# EAGLE design tiny_bot_v3 (EAGLE 6.5.0)
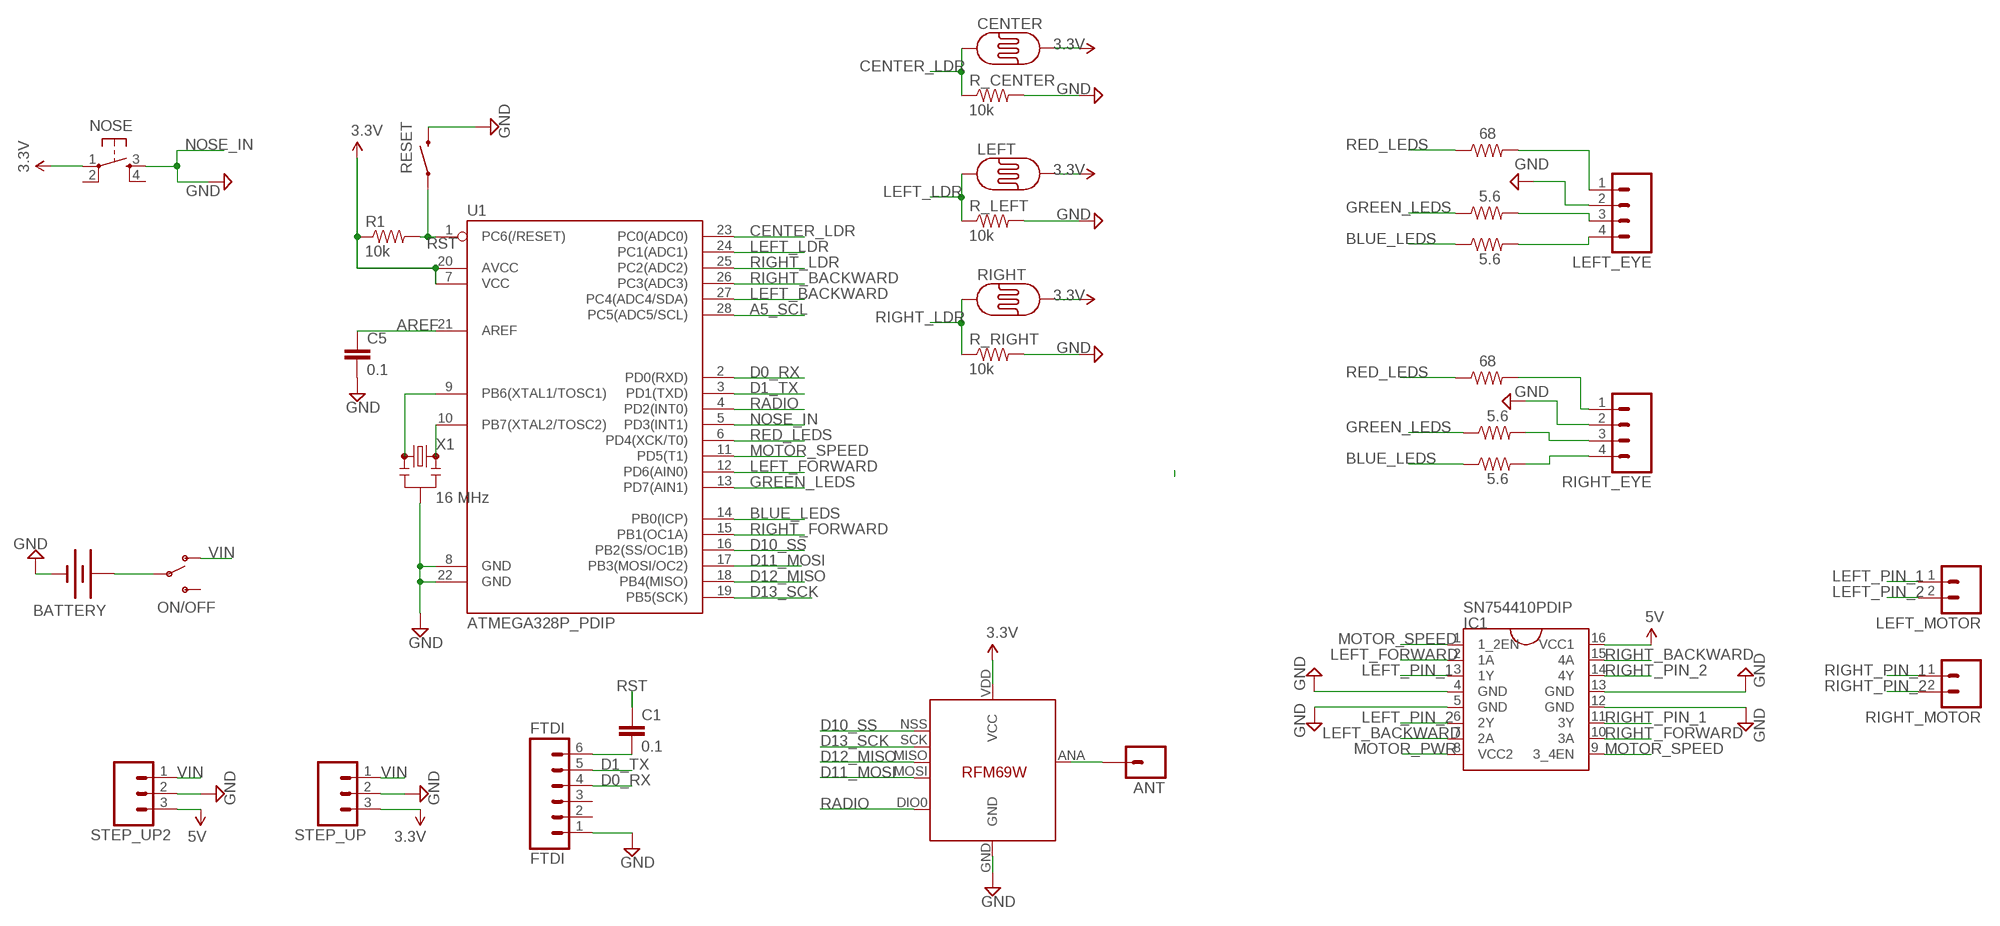
[diagram p0: schematic, sheet 1]

## Parts
ANT  M01PTH  [1X01]
BATTERY  BATTERYAAA  [BATTERY-AAA]
C1  0.1  CAPPTH  [CAP-PTH-SMALL]
C5  0.1  CAPPTH  [CAP-PTH-SMALL]
CENTER  PHOTOCELLPTH  [PHOTOCELL]
FTDI  FTDI  M06SIP  [1X06]
IC1  SN754410PDIP  [DIL16]
LEFT  PHOTOCELLPTH  [PHOTOCELL]
LEFT_BLUE  5.6  RESISTORPTH-1/4W  [AXIAL-0.4]
LEFT_EYE  M04LONGPADS  [1X04_LONGPADS]
LEFT_GREEN  5.6  RESISTORPTH-1/4W  [AXIAL-0.4]
LEFT_MOTOR  M02PTH  [1X02]
LEFT_RED  68  RESISTORPTH-1/4W  [AXIAL-0.4]
NOSE  TACTILE-SWITCH-PTH  [TAC-SWITCH-PTH]
ON/OFF  SWITCH-SPDTPTH  [SWITCH-SPDT]
R1  10k  RESISTORPTH-1/4W  [AXIAL-0.4]
R_CENTER  10k  RESISTORPTH-1/4W  [AXIAL-0.4]
R_LEFT  10k  RESISTORPTH-1/4W  [AXIAL-0.4]
R_RIGHT  10k  RESISTORPTH-1/4W  [AXIAL-0.4]
RESET  SWITCH-MOMENTARY-2SMD  [TACTILE-SWITCH-SMD]
RIGHT  PHOTOCELLPTH  [PHOTOCELL]
RIGHT_BLUE  5.6  RESISTORPTH-1/4W  [AXIAL-0.4]
RIGHT_EYE  M04LONGPADS  [1X04_LONGPADS]
RIGHT_GREEN  5.6  RESISTORPTH-1/4W  [AXIAL-0.4]
RIGHT_MOTOR  M02PTH  [1X02]
RIGHT_RED  68  RESISTORPTH-1/4W  [AXIAL-0.4]
STEP_UP  M03PTH  [1X03]
STEP_UP2  M03PTH  [1X03]
U1  ATMEGA328P_PDIP  [DIL28-3]
U$5  RFM69HW  RFM69  [RFM69W-MINPADS]
X1  16 MHz  RESONATORPTH  [RESONATOR-PTH]

## Nets
5V: IC1.16(VCC1) STEP_UP2.3
A5_SCL: U1.28(PC5(ADC5/SCL))
AREF: C5.1 U1.21(AREF)
BLUE_LEDS: LEFT_BLUE.P$1 RIGHT_BLUE.P$1 U1.14(PB0(ICP))
CENTER_LDR: CENTER.1 R_CENTER.P$1 U1.23(PC0(ADC0))
D0_RX: FTDI.4 U1.2(PD0(RXD))
D1_TX: FTDI.5 U1.3(PD1(TXD))
D10_SS: U1.16(PB2(SS/OC1B)) U$5.NSS(SEL)
D11_MOSI: U1.17(PB3(MOSI/OC2)) U$5.MOSI
D12_MISO: U1.18(PB4(MISO)) U$5.MISO
D13_SCK: U1.19(PB5(SCK)) U$5.SCK
GND [power]: BATTERY.GND@1(-) C5.2 FTDI.1 IC1.4(GND) IC1.5(GND) IC1.12(GND) IC1.13(GND) LEFT_EYE.2 R_CENTER.P$2 R_LEFT.P$2 R_RIGHT.P$2 RESET.3 RIGHT_EYE.2 STEP_UP2.2 STEP_UP.2 U1.8(GND) U1.22(GND) U$5.GND X1.2
GREEN_LEDS: LEFT_GREEN.P$1 RIGHT_GREEN.P$1 U1.13(PD7(AIN1))
LEFT_BACKWARD: IC1.7(2A) U1.27(PC4(ADC4/SDA))
LEFT_FORWARD: IC1.2(1A) U1.12(PD6(AIN0))
LEFT_LDR: LEFT.1 R_LEFT.P$1 U1.24(PC1(ADC1))
LEFT_PIN_1: IC1.3(1Y) LEFT_MOTOR.1
LEFT_PIN_2: IC1.6(2Y) LEFT_MOTOR.2
MOTOR_PWR: IC1.8(VCC2)
MOTOR_SPEED: IC1.1(1_2EN) IC1.9(3_4EN) U1.11(PD5(T1))
N$1: U1.9(PB6(XTAL1/TOSC1)) X1.1
N$2: ANT.1 U$5.ANA(ANT)
N$3: LEFT_EYE.1 LEFT_RED.P$2
N$4: RIGHT_EYE.1 RIGHT_RED.P$2
N$5: LEFT_EYE.3 LEFT_GREEN.P$2
N$6: LEFT_BLUE.P$2 LEFT_EYE.4
N$7: RIGHT_EYE.3 RIGHT_GREEN.P$2
N$8: RIGHT_BLUE.P$2 RIGHT_EYE.4
N$12: BATTERY.PWR@1(+) ON/OFF.2(P)
N$20: C1.2 FTDI.6
N$21: U1.10(PB7(XTAL2/TOSC2)) X1.3
NOSE_IN: NOSE.3 U1.5(PD3(INT1)) ; supply symbol labelled GND
RADIO: U1.4(PD2(INT0)) U$5.DIO0
RED_LEDS: LEFT_RED.P$1 RIGHT_RED.P$1 U1.6(PD4(XCK/T0))
RIGHT_BACKWARD: IC1.15(4A) U1.26(PC3(ADC3))
RIGHT_FORWARD: IC1.10(3A) U1.15(PB1(OC1A))
RIGHT_LDR: R_RIGHT.P$1 RIGHT.1 U1.25(PC2(ADC2))
RIGHT_PIN_1: IC1.11(3Y) RIGHT_MOTOR.1
RIGHT_PIN_2: IC1.14(4Y) RIGHT_MOTOR.2
RST: C1.1 R1.P$2 RESET.1 U1.1(PC6(/RESET))
VCC: CENTER.2 LEFT.2 NOSE.1 R1.P$1 RIGHT.2 STEP_UP.3 U1.7(VCC) U1.20(AVCC) U$5.VDD(VCC) ; supply symbol labelled 3.3V
VIN: ON/OFF.1(O) STEP_UP2.1 STEP_UP.1
Unconnected: FTDI.2 FTDI.3 NOSE.2 NOSE.4 ON/OFF.3(S)

## Library data of the parts
ANT = SparkFun-Connectors:M01: Header 1 Standard 1-pin 0.1" header. Use with straight break away headers (SKU : PRT-00116), right angle break away headers (PRT-00553), swiss pins (PRT-00743), machine pins (PRT-00117), and female headers (PRT-00115). SMTSO-256-ET is a "flush mount" nut for a 4-40 screw. The older package used to be too tight, and did not allow it to sit properly thru the drill hit. The latest (0.165DIA) fits nice and snug.
BATTERY = SparkFun-Electromechanical:BATTERY: Battery Holders Various common sizes : AA, AAA, 18650 (PRT-12895), 20mm coin cell and 12mm coin cell. 20MM_4LEGS, BATT-10373; PROD_ID: BATT-08571
C1 C5 = SparkFun-Passives:CAP: Capacitor Standard 0603 ceramic capacitor, and 0.1" leaded capacitor.
CENTER LEFT RIGHT = SparkFun-Sensors:PHOTOCELL: CdS photoresistor. This is a low cost way to detect light levels. Resistance decreases with more incoming light. SparkFun SKU: SEN-09088
FTDI = SparkFun-Connectors:M06: Header 6 Standard 6-pin 0.1" header. Use with straight break away headers (SKU : PRT-00116), right angle break away headers (PRT-00553), swiss pins (PRT-00743), machine pins (PRT-00117), and female headers (PRT-00115). Molex polarized connector foot print use with SKU : PRT-08094 with associated crimp pins and housings. NOTES ON THE VARIANTS LOCK and LOCK_LONGPADS... This footprint was designed to help hold the alignment of a through-hole component (i.e. 6-pin header) while soldering it into place. You may notice that each hole has been shifted either up or down by 0.005 of an inch from it's more standard position (which is a perfectly straight line). This slight alteration caused the pins (the squares in the middle) to touch the edges of the holes. Because they are alternating, it causes a "brace" to hold the component in place. 0.005 has proven to be the perfect amount of "off-center" position when using our standard breakaway headers. Although looks a little odd when you look at the bare footprint, once you have a header in there, the alteration is very hard to notice. Also, if you push a header all the way into place, it is covered up entirely on the bottom side. This idea of altering the position of holes to aid alignment will be further integrated into the Sparkfun Library for other footprints. It can help hold any component with 3 or more connection pins.
IC1 = AlexW-Eagle-Libraries:SN754410
LEFT_BLUE LEFT_GREEN LEFT_RED R1 R_CENTER R_LEFT R_RIGHT RIGHT_BLUE RIGHT_GREEN RIGHT_RED = SparkFun-Passives:RESISTOR: Resistor Basic schematic elements and footprints for 0603, 1206, and PTH resistors.
LEFT_EYE RIGHT_EYE = SparkFun-Connectors:M04: Header 4 Standard 4-pin 0.1" header. Use with straight break away headers (SKU : PRT-00116), right angle break away headers (PRT-00553), swiss pins (PRT-00743), machine pins (PRT-00117), and female headers (PRT-00115). Molex polarized connector foot print use with SKU : PRT-08231 with associated crimp pins and housings. 1MM SMD Version SKU: PRT-10208; PROD_ID: CONN-09696
LEFT_MOTOR RIGHT_MOTOR = SparkFun-Connectors:M02: Standard 2-pin 0.1" header. Use with - straight break away headers ( PRT-00116) - right angle break away headers (PRT-00553) - swiss pins (PRT-00743) - machine pins (PRT-00117) - female headers (PRT-00115) Molex polarized connector foot print use with: PRT-08233 with associated crimp pins and housings. 2.54_SCREWTERM for use with PRT-10571. 3.5mm Screw Terminal footprints for PRT-08084 5mm Screw Terminal footprints for use with PRT-08432
NOSE = GeekAmmo:TACTILE-SWITCH: Tactile Switch 4 Pins, SPST NO
ON/OFF = SparkFun-Electromechanical:SWITCH-SPDT: SPDT Switch Simple slide switch, Spark Fun Electronics SKU : COM-00102 DPDT SMT slide switch, AYZ0202, SWCH-08179; PROD_ID: SWCH-08261
RESET = SparkFun-Electromechanical:SWITCH-MOMENTARY-2: Various NO switches- pushbuttons, reed, etc; PROD_ID: SWCH-08247
STEP_UP STEP_UP2 = SparkFun-Connectors:M03: Header 3 Standard 3-pin 0.1" header. Use with straight break away headers (SKU : PRT-00116), right angle break away headers (PRT-00553), swiss pins (PRT-00743), machine pins (PRT-00117), and female headers (PRT-00115). Molex polarized connector foot print use with SKU : PRT-08232 with associated crimp pins and housings.
U1 = SparkFun-DigitalIC:ATMEGA328P_PDIP: uC used in the Arduino 32kb flash, 1k EEPROM, 2k SRAM This is the through-hole version of this chip.
U$5 = LowPowerLab:RFM69
X1 = SparkFun-FreqCtrl:RESONATOR: Resonator Small SMD resonator. Used, eg, on the Arduino Pro/ Pro Mini boards. 8MHz- XTAL-08895 16MHz- XTAL-08900

## Net classes
1 power: width 0.381 mm, clearance 0.254 mm

## Board
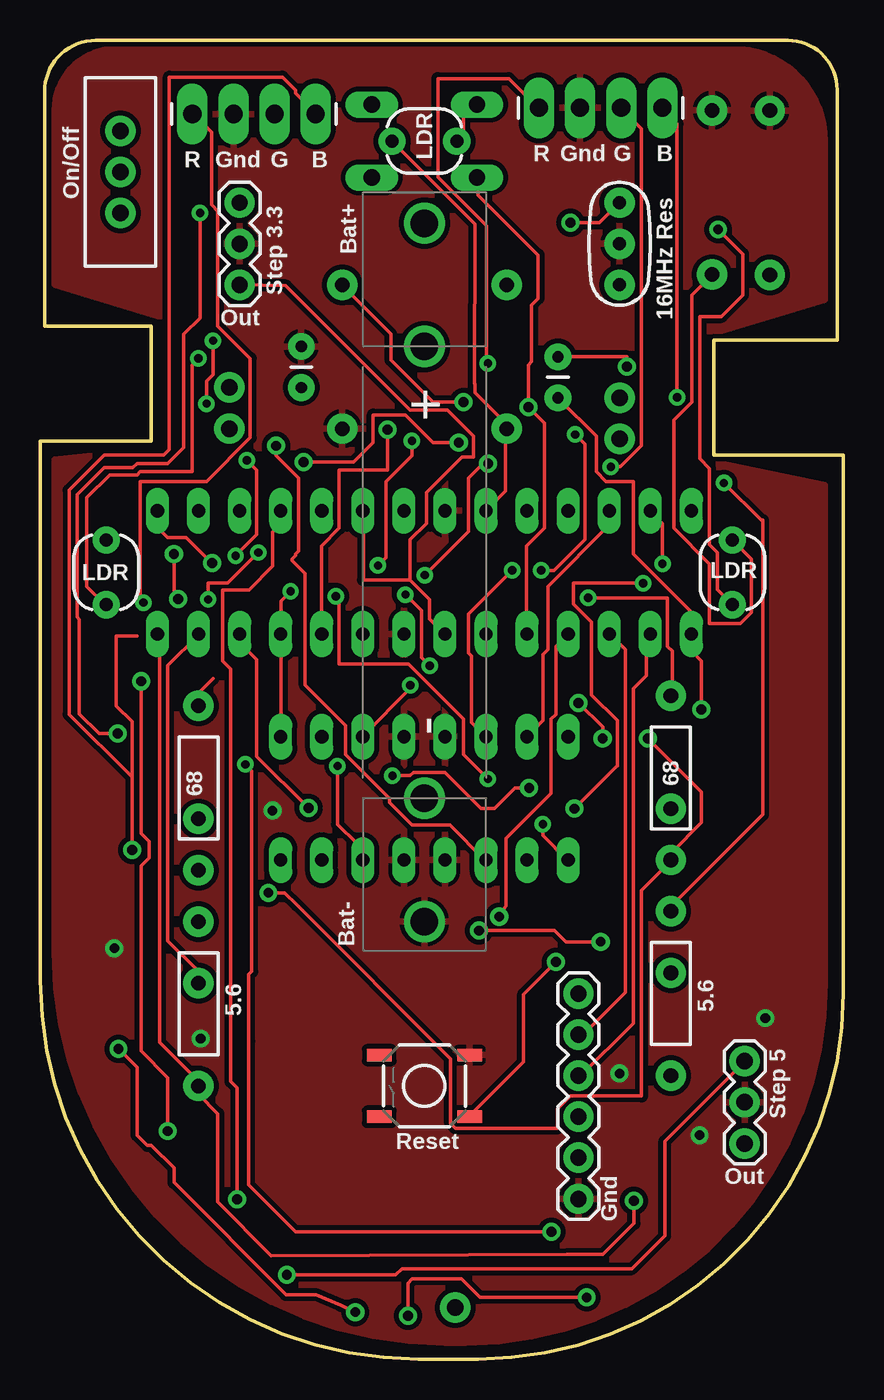
[diagram p1: board, top side]
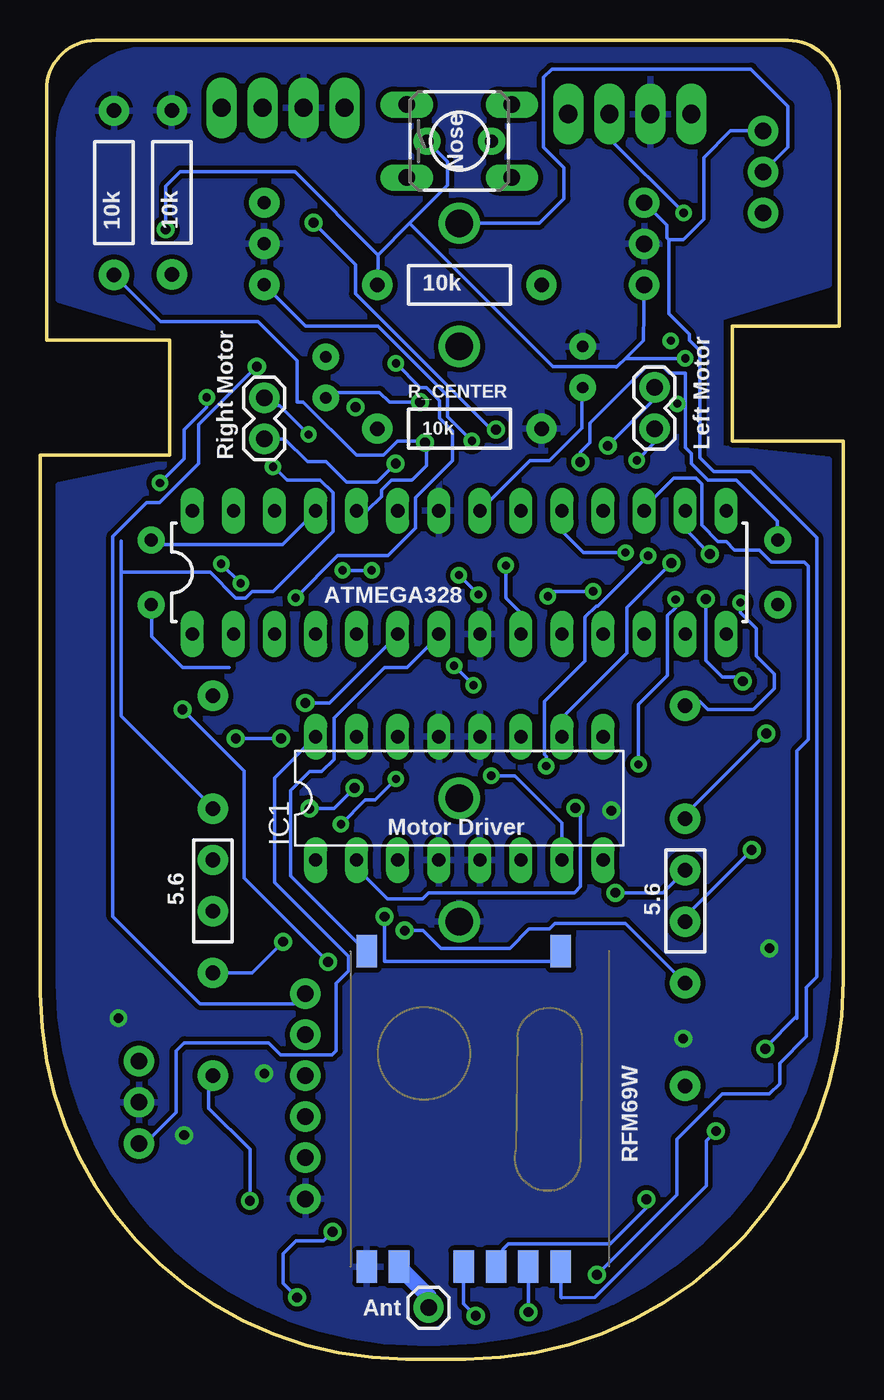
[diagram p2: board, bottom side, seen from below]

Size 49.66 x 81.53 mm. Coordinates in mm from the lower left corner, seen from the top.
Outline: 46.23,81.53 3.43,81.53 arc90 0.25,78.36 0.25,63.88 6.86,63.88 6.86,56.77 0,56.77 0,23.37 arc90 23.37,0 27.05,0 arc90 49.66,22.61 49.66,55.88 41.66,55.88 41.66,62.99 49.28,62.99 49.28,78.49 arc90 46.23,81.53
Copper layers (1*16): Top 0.035mm / dielectric 1.5mm / Bottom 0.035mm
Design rules "SparkFun": minimum track width 8mil, minimum drill 20mil, track to track 8mil, track to pad 8mil, pad to pad 8mil, via to via 8mil, smd to smd 8mil, copper to edge 10mil, drill to drill 8mil, minimum pad ring 12mil, minimum via ring 10mil, stop-mask expansion 4mil, vias tented up to drill 25mil, thermal gap 10mil

### Footprints (pad centres in the part's own frame; a part is rotated, then mirrored left to right if it is on the bottom)
1X01 = drill 1.016 pad 1.88: 1 0,0
BATTERY-AAA = drill 1.702: GND@1 21.59,0; GND@2 13.97,0; PWR@1 -21.59,0; PWR@2 -13.97,0
CAP-PTH-SMALL = drill 0.7 pad 1.651: 1 0,0; 2 2.54,0
PHOTOCELL = drill 0.8 pad 1.676: 1 -2,0; 2 2,0
1X06 = drill 1.016 pad 1.88: 1 0,0; 2 2.54,0; 3 5.08,0; 4 7.62,0; 5 10.16,0; 6 12.7,0
DIL16 = drill 0.813 long: 1 -8.89,-3.81; 2 -6.35,-3.81; 3 -3.81,-3.81; 4 -1.27,-3.81; 5 1.27,-3.81; 6 3.81,-3.81; 7 6.35,-3.81; 8 8.89,-3.81; 9 8.89,3.81; 10 6.35,3.81; 11 3.81,3.81; 12 1.27,3.81; 13 -1.27,3.81; 14 -3.81,3.81; 15 -6.35,3.81; 16 -8.89,3.81
AXIAL-0.4 = drill 0.9 pad 1.88: P$1 -5.08,0; P$2 5.08,0
1X04_LONGPADS = drill 1.118 pad 1.88 long: 1 0,0; 2 2.54,0; 3 5.08,0; 4 7.62,0
1X02 = drill 1.016 pad 1.88: 1 0,0; 2 2.54,0
TAC-SWITCH-PTH = drill 1.016 pad 1.524 long: 1 -3.251,2.261; 2 3.251,2.261; 3 -3.251,-2.261; 4 3.251,-2.261
SWITCH-SPDT = drill 1.016 pad 1.88: 1 0,2.54; 2 0,0; 3 0,-2.54
TACTILE-SWITCH-SMD = smd 1.524 x 0.762: 1 -2.794,1.905; 2 2.794,1.905; 3 -2.794,-1.905; 4 2.794,-1.905
1X03 = drill 1.016 pad 1.88: 1 0,0; 2 2.54,0; 3 5.08,0
DIL28-3 = drill 0.813 long: 1 -16.51,-3.81; 2 -13.97,-3.81; 3 -11.43,-3.81; 4 -8.89,-3.81; 5 -6.35,-3.81; 6 -3.81,-3.81; 7 -1.27,-3.81; 8 1.27,-3.81; 9 3.81,-3.81; 10 6.35,-3.81; 11 8.89,-3.81; 12 11.43,-3.81; 13 13.97,-3.81; 14 16.51,-3.81; 15 16.51,3.81; 16 13.97,3.81; 17 11.43,3.81; 18 8.89,3.81; 19 6.35,3.81; 20 3.81,3.81; 21 1.27,3.81; 22 -1.27,3.81; 23 -3.81,3.81; 24 -6.35,3.81; 25 -8.89,3.81; 26 -11.43,3.81; 27 -13.97,3.81; 28 -16.51,3.81
RFM69W-MINPADS = smd 2 x 1.27: ANA 8,-5; DIO0 -11.5,5; GND 8,-7; MISO 8,1; MOSI 8,3; NSS 8,5; SCK 8,-1; VDD -11.5,-7
RESONATOR-PTH = drill 0.8 pad 1.88: 1 -2.54,0; 2 0,0; 3 2.54,0

### Placement (x,y rotation side)
ANT  25.65,3.17 0 bottom
BATTERY  23.75,48.64 270 top
C1  32,59.44 90 top
C5  16.13,60.07 90 top
CENTER  23.75,75.31 0 top
FTDI  33.27,9.91 90 top
IC1  23.75,34.67 0 bottom
LEFT  4.06,48.64 270 top
LEFT_BLUE  9.78,21.97 90 top
LEFT_EYE  9.4,76.99 0 top
LEFT_GREEN  9.78,28.32 90 bottom
LEFT_MOTOR  11.68,60.07 270 bottom
LEFT_RED  9.78,35.31 90 top
NOSE  23.75,75.31 0 bottom
ON/OFF  4.95,73.41 0 top
R1  23.75,66.42 0 bottom
R_CENTER  23.75,57.53 0 bottom
R_LEFT  45.11,72.11 90 bottom
R_RIGHT  41.53,72.14 90 bottom
RESET  23.75,16.89 180 top
RIGHT  42.8,48.64 270 top
RIGHT_BLUE  38.99,22.61 90 top
RIGHT_EYE  30.84,77.37 0 top
RIGHT_GREEN  38.99,28.96 90 bottom
RIGHT_MOTOR  35.81,56.9 90 bottom
RIGHT_RED  38.99,35.94 90 top
STEP_UP  12.32,71.5 270 top
STEP_UP2  43.56,18.41 270 top
U1  23.75,48.64 0 bottom
U$5  22.48,13.72 270 bottom
X1  35.81,68.96 90 top

### Tracks (layer width: path | path; a pad name or v marks a point on that pad's centre or on a via)
5V
  Bottom 0.203: STEP_UP2.3 43.18,13.33 41.27,15.24 41.27,19.05 40.77,19.56 35.56,19.56 34.8,18.8 31.62,18.8 31.37,19.05 31.37,23.24 30.61,24 30.61,24.89 35.18,29.46 35.18,35.94 IC1.16
AREF
  Bottom 0.203: U1.21 22.47,52.47 19.37,55.57 18.17,55.57 16.17,57.57 16.17,60.07 C5.1
BLUE_LEDS  (via drill 0.6)
  Top 0.203: U1.14 7.27,44.77 7.37,44.67 7.37,19.57 9.77,17.17 9.77,16.97 LEFT_BLUE.P$1 9.77,16.77 9.77,16.37 10.97,15.17 10.95,9.72 14.27,6.39 32.57,6.47 34.79,6.47 36.7,8.38 v36.7,9.78
  Bottom 0.203: v36.7,9.78 36.7,12.95 39.24,15.49 39.24,17.27 RIGHT_BLUE.P$1
CENTER_LDR
  Top 0.203: U1.23 27.57,52.47 28.77,53.67 28.77,57.47 R_CENTER.P$1 | 28.77,57.77 28.77,57.57 R_CENTER.P$1 | R_CENTER.P$1 28.77,57.87 26.87,59.77 26.87,60.27 26.85,60.3 26.87,70.17 21.75,75.29 CENTER.1
D0_RX
  Top 0.203: U1.2 37.67,44.77 37.47,44.57 37.47,42.27 36.67,41.47 36.67,20.77 33.37,17.47 FTDI.4
D1_TX
  Top 0.203: FTDI.5 33.37,20.07 33.57,20.07 36.17,22.67 36.17,42.17 36.17,42.27 36.17,43.87 35.27,44.77 U1.3
D10_SS  (via drill 0.6, 0.61)
  Top 0.203: v6.22,41.91 6.22,32.51 6.73,32 6.73,30.99 6.22,30.48 6.22,19.05 7.87,17.4 v7.87,14.1 | v8.25,49.78 8.25,47.24 v8.51,46.99
  Bottom 0.203: U$5.NSS 17.47,5.77 17.47,3.83 17.42,3.79 15.36,3.81 8.47,10.72 8.47,13.5 v7.87,14.1 | v8.51,46.99 8.51,43.18 7.49,42.16 6.48,42.16 v6.22,41.91 | U1.16 9.78,51.31 v8.25,49.78
D11_MOSI  (via drill 0.6, 0.61)
  Top 0.203: v19.47,2.9 18.58,3.31 17.04,3.99 15.19,3.99 8.25,10.92 8.25,11.81 6.86,13.21 6.6,13.21 5.97,13.84 5.97,18.03 v4.83,19.18
  Bottom 0.203: 2.87,21.21 2.87,37.59 2.16,38.31 2.16,49.02 2.41,49.28 4.45,49.28 5.21,50.04 6.73,50.04 7.24,50.55 7.75,50.55 8.76,51.56 8.76,54.1 9.13,54.47 10.47,54.47 12.27,52.67 12.27,52.47 U1.17 | 2.87,21.21 2.87,21.07 | 19.47,5.77 U$5.MOSI | 19.47,5.77 19.47,6.17 | 19.47,5.77 v19.47,2.9 | v4.83,19.18 4.83,19.26 2.87,21.21
D12_MISO  (via drill 0.61)
  Top 0.203: U1.18 14.77,52.37 14.77,51.57 14.35,51.15 14.35,49.02 12.89,47.56 11.27,47.56 11.27,43.17 11.77,42.67 11.77,17.17 12.17,16.77 v12.17,9.87
  Bottom 0.203: v12.17,9.87 12.17,9.34 14.4,7.11 20.7,7.11 21.48,6.33 U$5.MISO
D13_SCK  (via drill 0.51, 0.6, 0.61)
  Top 0.203: v22.73,2.67 22.73,4.7 22.99,4.95 26.04,4.95 27.18,3.81 v33.78,3.81 | v31.6,7.87 15.77,7.87 12.88,10.77 12.88,19.66 12.87,19.7 12.87,23.77 13.07,23.97 13.07,36.37 v12.67,36.77 | v13.47,49.87 11.57,47.97 10.37,47.97 v10.37,46.97
  Bottom 0.203: U$5.SCK 23.48,3.41 v22.73,2.67 | v31.6,7.87 32.16,7.31 33.83,7.31 34.65,6.5 34.65,4.67 v33.78,3.81 | v13.47,49.87 16.07,49.87 17.37,51.17 17.37,52.37 U1.19 | v10.37,46.97 10.37,46.47 10.87,45.97 10.87,42.27 12.67,40.47 v12.67,36.77
GND  (via drill 0.6)
  other vias: 40.77,13.84 4.57,25.4 44.83,21.08 35.81,17.65 9.91,19.81 14.35,33.91
  pour Top (isolate 0.305): 42.8,81.03 4.7,81.03 arc90 0.89,77.22 0.89,66.42 7.6,64.38 7.6,56.33 0.89,55.63 0.89,25.15 arc90 25.02,1.02 26.29,1.02 arc90 48.51,23.24 48.51,54.03 40.89,55.63 40.89,63.21 48.51,65.51 48.51,75.31 arc90
  pour Bottom (isolate 0.305): 42.8,81.03 4.7,81.03 arc90 0.89,77.22 0.89,66.42 7.6,64.38 7.6,56.33 0.89,55.63 0.89,25.15 arc90 25.02,1.02 26.29,1.02 arc90 48.51,23.24 48.51,54.03 40.89,55.63 40.89,63.21 48.51,65.51 48.51,75.31 arc90
GREEN_LEDS  (via drill 0.61)
  Top 0.203: U1.13 9.77,44.77 7.87,42.87 7.87,25.87 9.77,23.97 9.77,23.27 LEFT_GREEN.P$1 | v34.65,25.81 32.49,25.81 31.8,26.49 v27.13,26.49
  Bottom 0.203: RIGHT_GREEN.P$1 36.58,23.88 v34.65,25.81 | v27.13,26.49 26.01,26.52 24.89,25.4 20.62,25.4 19.43,26.59 18.19,26.59 17.83,26.95 13.49,26.95 LEFT_GREEN.P$1
LEFT_BACKWARD  (via drill 0.51, 0.6)
  Top 0.203: v21.77,36.07 22.87,36.07 23.07,36.27 25.02,36.27 27.25,34.04 28.07,34.04 29.34,35.31 v30.23,35.31 | v38.47,49.17 38.47,51.67 37.77,52.37 U1.27 | v37.27,47.97 32.97,47.97 32.97,46.67 34.07,45.57 34.07,41.07 35.67,39.47 35.67,36.67 35.65,36.67 v33.02,34.04
  Bottom 0.203: v37.27,47.97 v38.47,49.17 | IC1.7 17.4,33.15 20.32,36.07 v21.77,36.07 | v33.02,34.04 31.5,34.04 v30.23,35.31
LEFT_FORWARD  (via drill 0.61)
  Top 0.203: v16.57,34.07 13.37,37.27 13.37,43.27 12.67,43.97 12.67,44.47 12.37,44.77 U1.12
  Bottom 0.203: IC1.2 30.1,30.35 28.19,28.45 26.04,28.45 25.65,28.83 16.64,28.83 16.26,29.21 16.26,33.75 v16.57,34.07
LEFT_LDR  (via drill 0.51, 0.61)
  Top 0.203: v25.87,56.67 24.27,56.67 22.57,58.37 20.57,58.37 20.57,56.67 19.37,55.47 v16.27,55.47 | v10.67,62.97 10.67,60.87 10.27,60.47 v10.27,59.07
  Bottom 0.203: v16.27,55.47 16.27,55.97 16.27,56.07 15.67,56.67 15.67,57.87 12.17,61.37 11.17,61.37 10.77,60.97 9.87,60.97 9.77,60.97 9.77,59.07 | 9.77,59.07 9.77,56.37 9.4,56 9.4,55.37 8.38,54.36 6.6,54.36 4.07,51.83 4.07,50.67 LEFT.1 | 9.77,59.07 v10.27,59.07 | U1.24 29.46,52.45 28.58,53.34 28.58,53.72 27.94,54.36 26.67,54.36 25.78,55.25 25.78,56.58 v25.87,56.67 25.97,56.77 27.56,56.77 28.45,55.88 30.1,55.88 33.4,59.18 33.78,59.18 33.78,61.72 36.2,64.14 42.21,64.14 R_LEFT.P$1
LEFT_PIN_1  (via drill 0.61)
  Top 0.203: v14.57,56.47 14.57,55.97 14.57,55.87 15.97,54.47 15.97,49.97 15.77,49.77 15.77,49.67 15.57,49.47 15.57,49.37 16.37,48.57 16.37,41.67 18.87,39.17 18.87,37.37 20.77,35.47 20.79,35.47 21.59,34.67 21.59,34.42 22.99,33.02 25.32,33.02 27.47,30.87 IC1.3
  Bottom 0.203: v14.57,56.47 11.77,59.27 11.77,60.07 LEFT_MOTOR.1
LEFT_PIN_2  (via drill 0.51)
  Top 0.203: v18.37,36.67 18.37,33.07 19.57,31.87 19.57,31.23 IC1.6 | v12.07,49.67 13.37,50.97 13.37,54.97 v12.77,55.57
  Bottom 0.203: v18.37,36.67 18.37,37.27 18.47,37.37 18.47,40.67 15.97,43.17 15.97,45.87 15.27,46.57 15.17,46.57 v12.07,49.67 | v12.77,55.57 11.67,56.67 11.67,57.47 LEFT_MOTOR.2
MOTOR_SPEED  (via drill 0.51)
  Top 0.203: IC1.9 14.87,38.57 14.87,44.77 U1.11 14.87,44.87 14.87,46.87 v15.47,47.47 | v31.07,33.07 31.07,32.37 32.57,30.87 IC1.1 | v27.67,35.87 26.17,37.37 26.17,39.57 22.77,42.97 18.47,42.97 18.47,46.97 v18.27,47.17
  Bottom 0.203: v31.07,33.07 29.57,34.57 28.97,34.57 v27.67,35.87 | v18.27,47.17 17.97,47.47 v15.47,47.47
N$1  (via drill 0.51)
  Top 0.203: v20.87,49.07 21.37,49.57 21.37,54.27 22.97,55.87 v22.97,56.77
  Bottom 0.203: v20.87,49.07 20.87,47.07 19.97,46.17 19.97,44.87 U1.9 | v22.97,56.77 24.47,58.27 24.47,59.57 28.77,63.87 33.26,63.87 X1.1
N$2
  Bottom 0.203: 27.47,5.67 U$5.ANA
  Bottom 1.016: ANT.1 25.65,3.89 U$5.ANA
N$3  (via drill 0.51)
  Top 0.203: 10.67,42.07 9.87,41.27 9.87,40.47 LEFT_RED.P$2 | v6.37,46.77 6.17,46.97 6.17,54.27 10.27,54.27 12.97,56.97 12.97,61.87 10.97,63.87 10.97,70.97 10.57,71.37 10.57,75.87 9.47,76.97 LEFT_EYE.1
  Bottom 0.203: v6.37,46.77 6.37,46.17 5.37,45.17 5.37,43.47 4.27,42.37 4.27,41.47 5.57,40.17 8.37,40.17 8.87,40.67 9.57,40.67 9.77,40.47 LEFT_RED.P$2
N$4  (via drill 0.51)
  Top 0.203: RIGHT_RED.P$2 39.07,41.07 39.07,43.67 39.07,43.77 38.77,44.07 38.77,47.07 v33.87,47.07 | v27.67,61.57 27.57,61.67 27.57,70.07 24.57,73.07 24.57,79.17 28.97,79.17 30.77,77.37 RIGHT_EYE.1
  Bottom 0.203: v27.67,61.57 26.17,60.07 25.77,60.07 24.97,59.27 24.97,58.17 24.17,57.37 24.17,55.57 26.47,53.27 26.47,51.37 28.17,49.67 31.27,49.67 v33.87,47.07
N$5  (via drill 0.51, 0.61)
  Top 0.203: v4.77,38.67 3.62,38.67 2.41,39.88 2.41,45.73 2.27,45.87 2.27,53.45 3.94,55.12 5.71,55.12 5.97,55.37 7.88,55.37 8.87,56.37 8.87,63.37 9.87,64.37 9.87,64.47 v9.87,70.87
  Bottom 0.203: v4.77,38.67 9.77,33.67 9.77,33.47 LEFT_GREEN.P$2 | v9.87,70.87 14.47,75.47 14.47,76.97 LEFT_EYE.3
N$6  (via drill 0.61)
  Top 0.203: v5.67,31.47 5.67,36.07 | 5.67,36.07 5.67,39.41 4.7,40.39 4.7,44.7 5.97,44.7 | LEFT_EYE.4 16.97,77.07 15.77,78.27 15.77,78.47 14.97,79.27 7.97,79.27 7.97,56.23 7.62,55.88 3.94,55.88 1.78,53.72 1.78,39.88 1.77,39.87 5.57,36.07 5.67,36.07
  Bottom 0.203: v5.67,31.47 9.77,27.37 9.77,27.07 LEFT_BLUE.P$2
N$7  (via drill 0.51)
  Top 0.203: v35.27,55.17 35.87,55.17 37.17,56.47 37.17,76.07 35.97,77.27 RIGHT_EYE.3
  Bottom 0.203: 44.67,48.67 44.67,39.77 38.97,34.07 RIGHT_GREEN.P$2 | 44.67,48.67 44.67,50.57 | 44.67,48.67 39.17,48.67 37.57,47.07 36.97,47.07 36.57,47.47 35.27,47.47 31.57,51.17 31.57,53.57 32.36,54.36 34.42,54.36 35.23,55.17 v35.27,55.17
N$8  (via drill 0.51)
  Top 0.203: RIGHT_BLUE.P$2 39.07,27.77 39.07,28.07 44.67,33.67 44.67,51.87 44.57,51.87 v42.27,54.17 | v39.37,59.47 39.37,76.37 38.47,77.27 RIGHT_EYE.4
  Bottom 0.203: v39.37,59.47 39.37,58.87 40.77,57.47 40.77,55.67 v42.27,54.17
N$12
  Bottom 0.203: BATTERY.PWR@1 18.8,70.23 17.27,71.75 17.27,73.66 18.54,74.93 18.54,79.25 18.03,79.76 5.71,79.76 3.43,77.47 3.43,74.93 ON/OFF.2
N$20  (via drill 0.61)
  Top 0.203: v36.27,61.37 36.27,61.97 32.07,61.97 C1.2 | v36.27,61.37
  Bottom 0.203: v36.27,61.37 39.87,57.77 39.87,55.37 42.27,52.97 43.07,52.97 45.17,50.87 45.17,27.37 39.77,21.97 33.97,21.97 33.37,22.57 FTDI.6
N$21  (via drill 0.61)
  Top 0.203: v21.47,57.47 21.47,54.97 18.47,54.97 18.47,51.37 17.37,50.27 17.37,44.87 U1.10 | v32.77,70.27 34.58,70.27 X1.3
  Bottom 0.203: v21.47,57.47 21.77,57.47 30.17,65.87 30.17,67.67 v32.77,70.27
NOSE_IN  (via drill 0.61)
  Top 0.203: NOSE.3 27.07,72.97 27.07,71.97 30.77,68.27 30.77,65.57 30.37,65.17 30.37,61.67 30.17,61.47 v30.17,58.87 31.17,57.87 31.17,51.37 30.07,50.27 30.07,44.87 U1.5
  Bottom 0.203: 30.17,46.07 30.17,44.87 U1.5
RADIO  (via drill 0.61)
  Top 0.203: v28.37,27.36 28.8,28.01 28.8,31.97 28.8,32.2 31.57,34.97 31.57,39.57 31.87,39.87 31.87,44.07 32.57,44.77 U1.4
  Bottom 0.203: 17.59,25.32 U$5.DIO0 18.11,24.59 28.37,24.59 v28.37,27.36
RED_LEDS  (via drill 0.6, 0.61)
  Top 0.203: v33.27,40.57 34.77,39.07 v34.77,38.37 | v37.57,38.37 40.87,35.07 40.87,33.17 39.07,31.37 39.07,30.87 RIGHT_RED.P$1 38.97,30.77 37.17,28.97 37.17,16.27 32.77,16.27 31.97,15.47 31.97,14.27 25.67,14.27 25.37,14.57 25.37,18.57 15.87,28.07 15.11,28.83 v14.1,28.83
  Bottom 0.203: v33.27,40.57 31.77,40.57 27.57,44.77 U1.6 | v37.57,38.37 v34.77,38.37 | v14.1,28.83 11.18,28.83 LEFT_RED.P$1
RIGHT_BACKWARD
  Top 0.203: IC1.15 30.17,38.57 31.07,39.47 31.07,43.57 31.37,43.87 31.37,47.77 35.17,51.57 35.17,52.37 U1.26
RIGHT_FORWARD  (via drill 0.61)
  Top 0.203: v10.63,49.22 10.6,49.22 9.02,50.8 7.87,50.8 7.24,51.44 U1.15
  Bottom 0.203: v10.63,49.22 13.37,46.47 13.37,43.67 17.37,39.67 17.37,38.57 IC1.10
RIGHT_LDR
  Top 0.203: RIGHT.1 42.87,50.57 43.97,49.47 43.97,46.17 43.27,45.47 41.37,45.47 41.37,49.17 39.17,51.37 39.17,58.07 40.27,59.17 40.27,65.77 R_RIGHT.P$1
  Bottom 0.203: RIGHT.1 42.77,50.57 42.57,50.37 34.67,50.37 32.67,52.37 32.67,52.47 U1.25
RIGHT_PIN_1  (via drill 0.51, 0.6)
  Top 0.203: v22.87,41.67 22.87,41.47 19.97,38.57 IC1.11 | v24.07,42.87 23.57,43.37 23.57,46.27 v22.57,47.27 | v23.77,48.47 26.47,51.17 26.47,54.47 27.38,55.37 v27.69,55.37
  Bottom 0.203: v24.07,42.87 v22.87,41.67 | v23.77,48.47 v22.57,47.27 | v27.69,55.37 28.83,54.23 30.73,54.23 32,55.5 33.15,55.5 34.54,56.9 RIGHT_MOTOR.1
RIGHT_PIN_2  (via drill 0.51)
  Top 0.203: v29.17,48.77 26.47,46.07 26.47,43.67 26.67,43.47 26.67,39.37 27.47,38.57 IC1.14 | v30.97,48.77 31.77,48.77 33.67,50.67 33.67,56.57 v33.07,57.17
  Bottom 0.203: v30.97,48.77 v29.17,48.77 | v33.07,57.17 34.87,58.97 34.97,58.97 35.37,59.37 35.77,59.37 RIGHT_MOTOR.2
RST  (via drill 0.61)
  Top 0.203: v40.87,40.17 40.87,43.17 40.27,43.77 40.27,44.77 U1.1 40.17,44.87 40.17,46.27 36.67,49.77 36.67,54.27 34.97,54.27 34.37,54.87 34.37,57.07 32.07,59.37 C1.1 | RESET.1 26.57,15.07 29.87,18.37 29.87,22.56 v31.88,24.56 | v26.17,59.17 24.27,59.17 21.67,61.77 21.67,63.37 18.67,66.37 R1.P$2
  Bottom 0.203: v40.87,40.17 37.07,36.37 37.07,29.76 v31.88,24.56 | v26.17,59.17 28.07,59.17 28.67,59.77 31.67,59.77 C1.1
VCC  (via drill 0.51, 0.6)
  Top 0.203: NOSE.1 26.97,77.57 26.17,76.77 26.17,75.73 CENTER.2 | 22.87,48.17 24.07,46.97 24.07,45.77 24.97,44.87 U1.7 | 22.87,48.17 19.97,48.17 19.97,52.37 U1.20 | v9.77,61.87 9.37,61.47 9.37,54.87 6.17,54.87 5.97,54.67 4.27,54.67 2.87,53.27 2.87,47.77 3.97,46.67 LEFT.2 | RIGHT.2 42.77,46.67 41.87,47.57 41.87,49.87 41.37,50.37 41.37,55.07 40.77,55.67 40.77,64.47 42.12,64.47 43.43,65.79 43.43,68.33 v41.91,69.85 | 22.87,48.17 22.87,50.67 23.87,51.67 23.87,53.57 26.07,55.77 26.77,55.77 26.77,57.07 25.17,58.67 22.87,58.67 15.17,66.37 STEP_UP.3
  Bottom 0.203: U$5.VDD 29.57,25.27 34.17,29.87 34.17,35.17 33.02,36.32 32.26,36.32 31.5,37.08 31.5,39.65 28.37,42.77 26.97,42.77 24.97,44.77 24.97,44.87 U1.7 | 37.97,42.77 40.87,42.77 42.77,44.67 42.77,46.57 RIGHT.2 | 4.07,46.57 LEFT.2 | 28.77,68.27 28.77,66.47 R1.P$1 | 26.82,70.22 24.47,72.57 24.47,74.03 CENTER.2 | 26.82,70.22 28.77,68.27 | 19.97,51.67 19.97,52.37 U1.20 19.97,52.57 19.97,52.97 | 13.42,61.92 14.02,61.32 14.07,61.37 17.97,61.37 26.82,70.22 | 13.42,61.92 12.37,62.97 STEP_UP.3 | 28.77,68.27 33.91,73.41 41.02,73.41 41.91,72.52 v41.91,69.85 | v9.77,61.87 13.37,61.87 13.42,61.92
VIN  (via drill 0.6)
  Top 0.203: v15.24,5.21 21.97,5.21 22.35,5.59 36.58,5.59 38.61,7.62 38.61,13.46 STEP_UP2.1
  Bottom 0.203: ON/OFF.1 6.99,75.95 8.64,74.3 8.64,70.48 9.91,69.21 10.79,69.21 | 10.79,69.21 10.92,69.34 10.92,70.1 STEP_UP.1 | 10.79,69.21 10.79,64.64 9.52,63.37 9.52,62.99 8.89,62.36 8.89,55.75 8,54.86 5.71,54.86 1.65,50.8 1.65,23.62 2.29,22.99 2.29,19.94 3.94,18.29 3.94,17.02 4.57,16.38 7.49,16.38 10.29,13.59 10.29,10.16 v15.24,5.21

### Text on the board
tPlace: On/Off | LDR | R | Gnd | G | B | R | Gnd | G | B | Bat+ | Step 3.3 | Out | 16MHz Res | LDR | LDR | Bat- | Step 5 | Reset | Out | Gnd
bPlace: Nose | Left Motor | Right Motor | ATMEGA328 | Motor Driver | RFM69W | Ant